# EAGLE schematic Temperature (EAGLE 7.2.0)
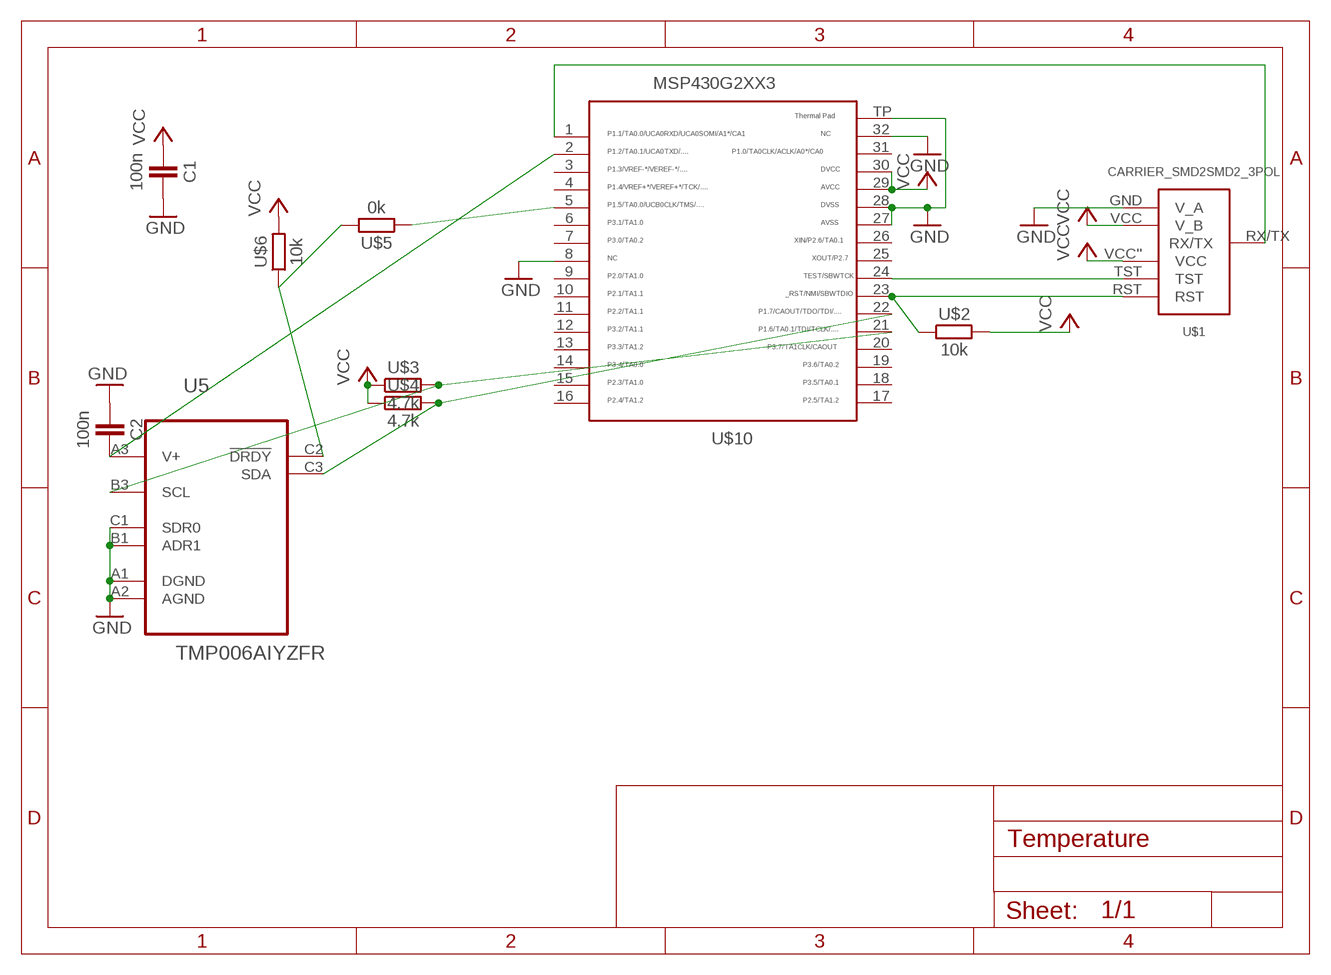
[diagram p0: schematic, sheet 1]

## Parts
C1  100n  CAPACITOR  [603]
C2  100n  CAPACITOR  [603]
U5  TMP006AIYZFR  [BGA8C50P3X3_156X156X63]
U$1  CARRIER_SMD2SMD2_3POL  [CARRIER_SMD2_3POL]
U$2  10k  RESISTOR0603  [603]
U$3  4.7k  RESISTOR0603  [603]
U$4  4.7k  RESISTOR0603  [603]
U$5  0k  RESISTOR1206  [1206]
U$6  10k  RESISTOR0603  [603]
U$10  MSP430G2553  [QFN32]

## Nets
GND: C1.2 C2.1 U5.A1(DGND) U5.A2(AGND) U5.B1(ADR1) U5.C1(SDR0) U$1.GND(V_A) U$10.8 U$10.27 U$10.28 U$10.32 U$10.TP
N$2: U$5.1 U$10.5
N$3: U$1.TST U$10.24
N$4: U$1.RST U$2.1 U$10.23
N$5: U5.C3(SDA) U$4.2 U$10.22
N$6: U5.B3(SCL) U$3.2 U$10.21
N$7: C2.2 U5.A3(V+) U$10.2
N$12: U$1.RX/TX U$10.1
N$14: U5.C2(!DRDY) U$5.2 U$6.1
VCC: C1.1 U$1.VCC''(VCC) U$1.VCC(V_B) U$2.2 U$3.1 U$4.1 U$6.2 U$10.29 U$10.30
Unconnected: U$10.3 U$10.4 U$10.6 U$10.7 U$10.9 U$10.10 U$10.11 U$10.12 U$10.13 U$10.14 U$10.15 U$10.16 U$10.17 U$10.18 U$10.19 U$10.20 U$10.25 U$10.26 U$10.31

## Library data of the parts
C1 C2 = thar:CAPACITOR
U5 = TMP006:TMP006AIYZFR: Infrared Thermopile Sensor,DSBGA-8; MPN: TMP006AIYZFR; OC_FARNELL: 1909481; OC_NEWARK: 52T8758; PACKAGE: DSBGA-8; SUPPLIER: TEXAS INSTRUMENTS
U$1 = thar:CARRIER_SMD2
U$2-U$6 = thar:RESISTOR
U$10 = thar:MSP430G2553: TEXAS INSTRUMENTS MSP430G2553IRHB32R MCU, 16BIT, MSP430, 16MHZ, QFN-32 Farnell Best.Nr.: 2325726 Herst.Bez.: MSP430G2553IRHB32R